# EAGLE schematic supply (EAGLE 5.10)
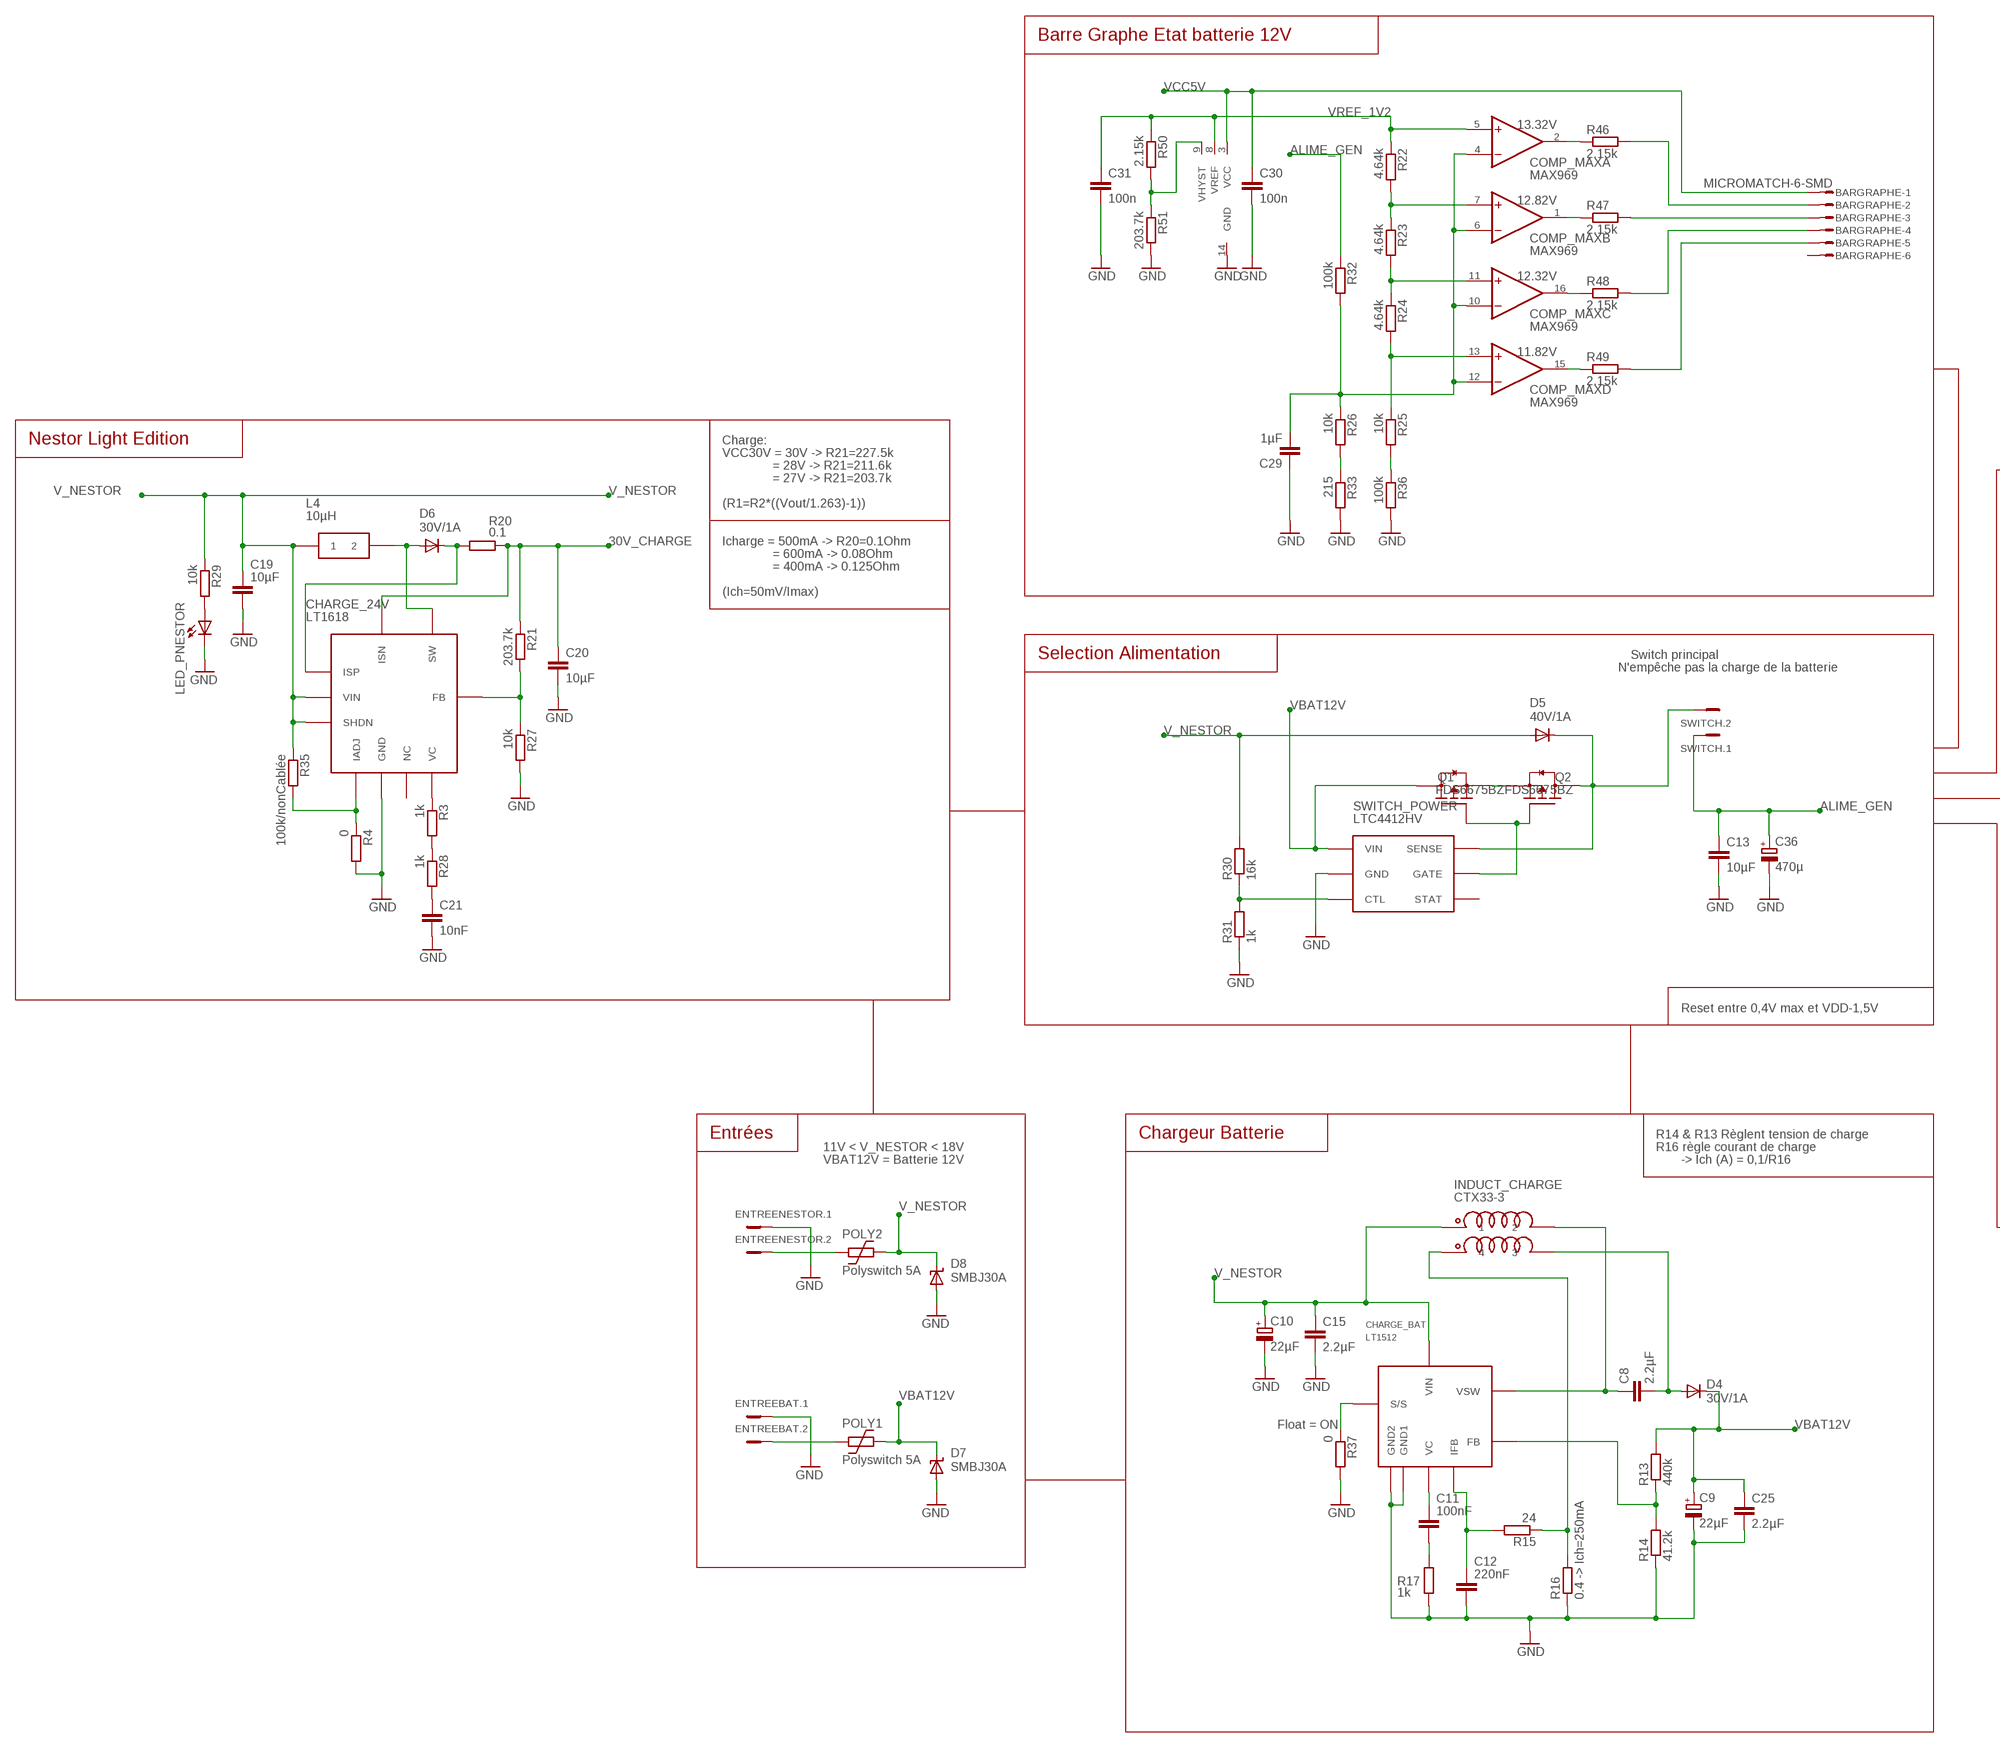
[diagram p0: schematic, sheet 1, part 1 of 2]
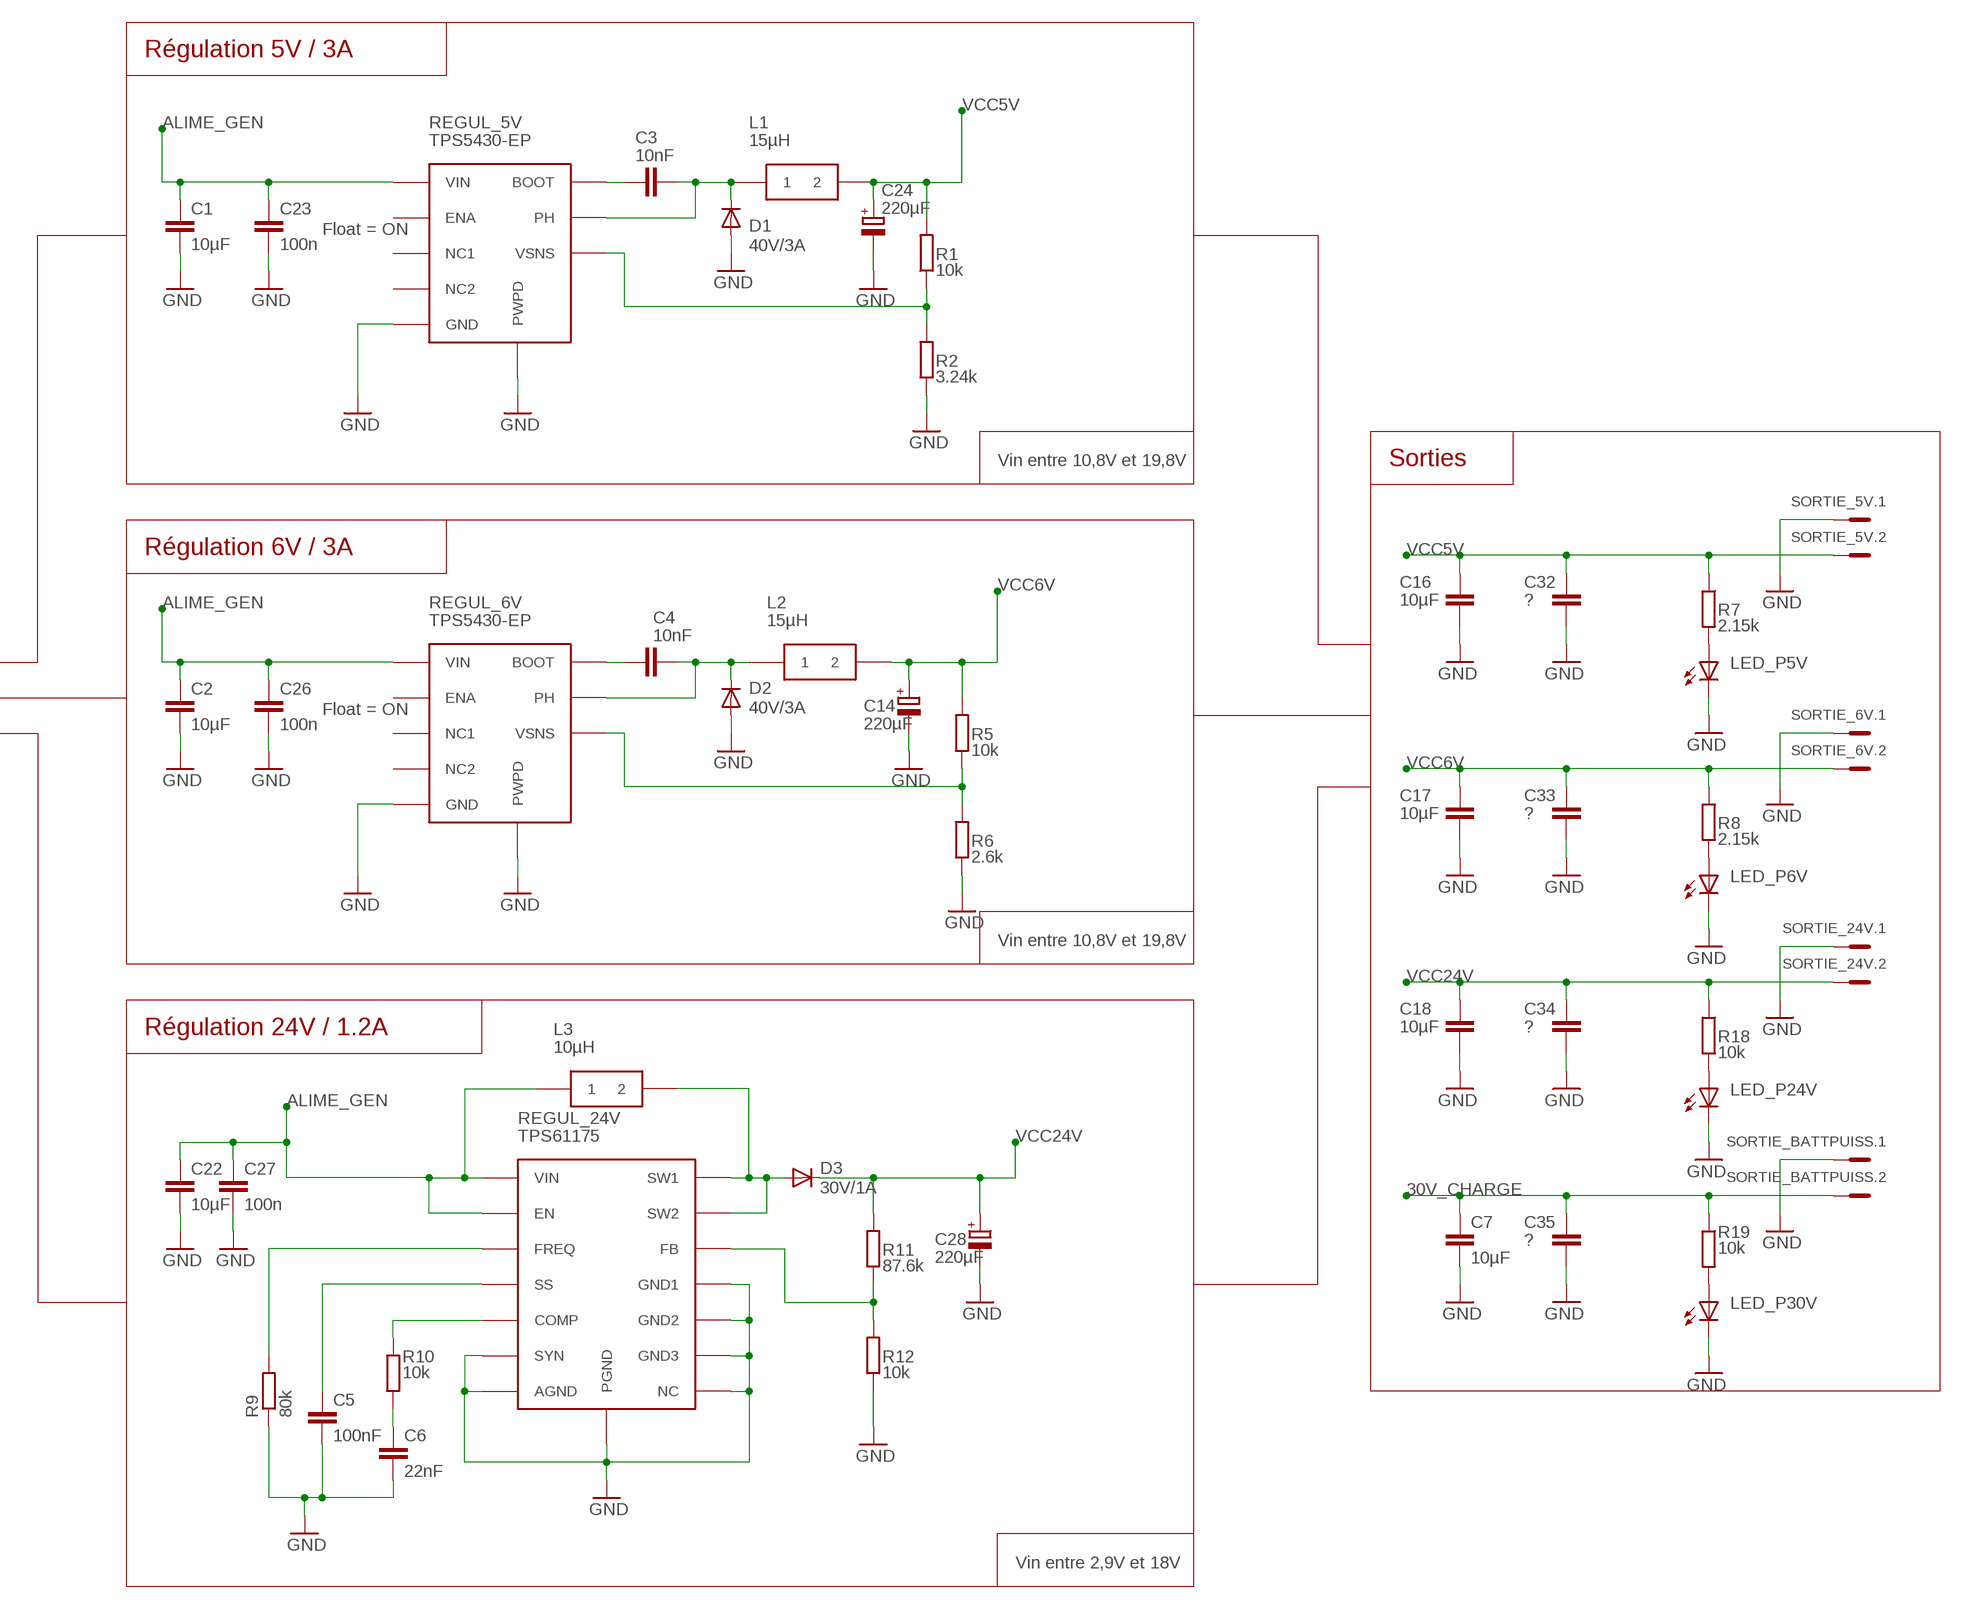
[diagram p1: schematic, sheet 1, part 2 of 2]

## Parts
BARGRAPHE  MICROMATCH-6-SMD  [MICROMATCH-6-SMD]
C1  10µF  C-EUC1210  [C1210]
C2  10µF  C-EUC1210  [C1210]
C3  10nF  C-EUC0603  [C0603]
C4  10nF  C-EUC0603  [C0603]
C5  100nF  C-EUC0603  [C0603]
C6  22nF  C-EUC0603  [C0603]
C7  10µF  C-EUC1210  [C1210]
C8  2.2µF  C-EUC0805  [C0805]
C9  22µF  CPOL-EUD/7343-31R  [D/7343-31R]
C10  22µF  CPOL-EUD/7343-31R  [D/7343-31R]
C11  100nF  C-EUC0603  [C0603]
C12  220nF  C-EUC0603  [C0603]
C13  10µF  C-EUC1210  [C1210]
C14  220µF  CPOL-EUD/7343-31R  [D/7343-31R]
C15  2.2µF  C-EUC0805  [C0805]
C16  10µF  C-EUC1210  [C1210]
C17  10µF  C-EUC1210  [C1210]
C18  10µF  C-EUC1210  [C1210]
C19  10µF  C-EUC1210  [C1210]
C20  10µF  C-EUC1210  [C1210]
C21  10nF  C-EUC0603  [C0603]
C22  10µF  C-EUC1210  [C1210]
C23  100n  C-EUC0603  [C0603]
C24  220µF  CPOL-EUD/7343-31R  [D/7343-31R]
C25  2.2µF  C-EUC0805  [C0805]
C26  100n  C-EUC0603  [C0603]
C27  100n  C-EUC0603  [C0603]
C28  220µF  CPOL-EUD/7343-31R  [D/7343-31R]
C29  1µF  C-EUC0603  [C0603]
C30  100n  C-EUC0603  [C0603]
C31  100n  C-EUC0603  [C0603]
C32  ?  C-EUC1210  [C1210]
C33  ?  C-EUC1210  [C1210]
C34  ?  C-EUC1210  [C1210]
C35  ?  C-EUC1210  [C1210]
C36  470µ  CPOL-EUE5-5  [E5-5]
CHARGE_24V  LT1618  [MSOP10]
CHARGE_BAT  LT1512  [LT1512]
COMP_MAX  MAX969  [QSOP16]
D1  40V/3A  DIODE-SMB  [SMB]
D2  40V/3A  DIODE-SMB  [SMB]
D3  30V/1A  DIODE-SMB  [SMB]
D4  30V/1A  DIODE-SMB  [SMB]
D5  40V/1A  DIODE-SMB  [SMB]
D6  30V/1A  DIODE-SMB  [SMB]
D7  SMBJ30A  SUPPRESSOR-SMBJ  [SMBJ]
D8  SMBJ30A  SUPPRESSOR-SMBJ  [SMBJ]
ENTREEBAT  MC2  [MC2]
ENTREENESTOR  MC2  [MC2]
INDUCT_CHARGE  CTX33-3  [CTX33-3]
L1  15µH  INDUCTANCE1  [INDUCTANCE]
L2  15µH  INDUCTANCE1  [INDUCTANCE]
L3  10µH  INDUCTANCE1  [INDUCTANCE]
L4  10µH  INDUCTANCE2  [INDUCTANCE2]
LED_P5V  Bling  LEDCHIPLED_1206  [CHIPLED_1206]
LED_P6V  Bling  LEDCHIPLED_1206  [CHIPLED_1206]
LED_P24V  Bling  LEDCHIPLED_1206  [CHIPLED_1206]
LED_P30V  Bling  LEDCHIPLED_1206  [CHIPLED_1206]
LED_PNESTOR  Bling  LEDCHIPLED_1206  [CHIPLED_1206]
POLY1  Polyswitch 5A  POLYSWITCH_0411/12  [0411/12]
POLY2  Polyswitch 5A  POLYSWITCH_0411/12  [0411/12]
Q1  FDS6675BZ  MOSFET-PCH_SO-8  [SOIC127P600X175-8AN]
Q2  FDS6675BZ  MOSFET-PCH_SO-8  [SOIC127P600X175-8AN]
R1  10k  R-EU_R0603  [R0603]
R2  3.24k  R-EU_R0603  [R0603]
R3  1k  R-EU_R0603  [R0603]
R4  0  R-EU_R0603  [R0603]
R5  10k  R-EU_R0603  [R0603]
R6  2.6k  R-EU_R0603  [R0603]
R7  2.15k  R-EU_R0603  [R0603]
R8  2.15k  R-EU_R0603  [R0603]
R9  80k  R-EU_R0603  [R0603]
R10  10k  R-EU_R0603  [R0603]
R11  87.6k  R-EU_R0603  [R0603]
R12  10k  R-EU_R0603  [R0603]
R13  440k  R-EU_R0603  [R0603]
R14  41.2k  R-EU_R0603  [R0603]
R15  24  R-EU_R0603  [R0603]
R16  0.4 -> Ich=250mA  R-EU_R0603  [R0603]
R17  1k  R-EU_R0603  [R0603]
R18  10k  R-EU_R0603  [R0603]
R19  10k  R-EU_R0603  [R0603]
R20  0.1  R-EU_R0603  [R0603]
R21  203.7k  R-EU_R0603  [R0603]
R22  4.64k  R-EU_R0603  [R0603]
R23  4.64k  R-EU_R0603  [R0603]
R24  4.64k  R-EU_R0603  [R0603]
R25  10k  R-EU_R0603  [R0603]
R26  10k  R-EU_R0603  [R0603]
R27  10k  R-EU_R0603  [R0603]
R28  1k  R-EU_R0603  [R0603]
R29  10k  R-EU_R0603  [R0603]
R30  16k  R-EU_R0603  [R0603]
R31  1k  R-EU_R0603  [R0603]
R32  100k  R-EU_R0603  [R0603]
R33  215  R-EU_R0603  [R0603]
R35  100k/nonCablée  R-EU_R0603  [R0603]
R36  100k  R-EU_R0603  [R0603]
R37  0  R-EU_R0603  [R0603]
R46  2.15k  R-EU_R0603  [R0603]
R47  2.15k  R-EU_R0603  [R0603]
R48  2.15k  R-EU_R0603  [R0603]
R49  2.15k  R-EU_R0603  [R0603]
R50  2.15k  R-EU_R0603  [R0603]
R51  203.7k  R-EU_R0603  [R0603]
REGUL_5V  TPS5430-EP  [TPS5430-EP]
REGUL_6V  TPS5430-EP  [TPS5430-EP]
REGUL_24V  TPS61175  [TPS61175]
SORTIE_5V  MC2  [MC2]
SORTIE_6V  MC2  [MC2]
SORTIE_24V  MC2  [MC2]
SORTIE_BATTPUISS  MC2  [MC2]
SWITCH  MC2  [MC2]
SWITCH_POWER  LTC4412HV  [LTC4412HV]

## Nets
30V_CHARGE: C7.1 C20.1 C35.1 CHARGE_24V.2(ISN) R19.1 R20.1 R21.1 SORTIE_BATTPUISS.2
ALIME_GEN: C1.1 C2.1 C13.1 C22.1 C23.1 C26.1 C27.1 C36.+ L3.P$1 R32.1 REGUL_5V.P$7(VIN) REGUL_6V.P$7(VIN) REGUL_24V.P$3(VIN) REGUL_24V.P$4(EN) SWITCH.1
GND: C1.2 C2.2 C5.2 C6.2 C7.2 C9.- C10.- C12.2 C13.2 C14.- C15.2 C16.2 C17.2 C18.2 C19.2 C20.2 C21.2 C22.2 C23.2 C24.- C25.2 C26.2 C27.2 C28.- C29.1 C30.2 C31.2 C32.2 C33.2 C34.2 C35.2 C36.- CHARGE_24V.5(GND) CHARGE_BAT.P$6(GND2) CHARGE_BAT.P$7(GND1) COMP_MAX.14(GND) D1.A D2.A D7.A D8.A ENTREEBAT.1 ENTREENESTOR.1 LED_P5V.C LED_P6V.C LED_P24V.C LED_P30V.C LED_PNESTOR.C R2.1 R4.2 R6.1 R9.1 R12.1 R14.1 R16.1 R17.1 R27.2 R31.1 R33.2 R36.2 R37.2 R51.2 REGUL_5V.P$6(GND) REGUL_5V.P$9(PWPD) REGUL_6V.P$6(GND) REGUL_6V.P$9(PWPD) REGUL_24V.P$6(SYN) REGUL_24V.P$7(AGND) REGUL_24V.P$11(NC) REGUL_24V.P$12(GND1) REGUL_24V.P$13(GND2) REGUL_24V.P$14(GND3) REGUL_24V.P$15(PGND) SORTIE_5V.1 SORTIE_6V.1 SORTIE_24V.1 SORTIE_BATTPUISS.1 SWITCH_POWER.P$2(GND)
N$2: C4.1 REGUL_6V.P$1(BOOT)
N$3: C3.1 REGUL_5V.P$1(BOOT)
N$4: C3.2 D1.C L1.P$1 REGUL_5V.P$8(PH)
N$5: R1.1 R2.2 REGUL_5V.P$4(VSNS)
N$6: C4.2 D2.C L2.P$1 REGUL_6V.P$8(PH)
N$7: R5.1 R6.2 REGUL_6V.P$4(VSNS)
N$8: CHARGE_24V.10(VC) R3.1
N$9: R11.1 R12.2 REGUL_24V.P$9(FB)
N$10: D3.A L3.P$2 REGUL_24V.P$1(SW1) REGUL_24V.P$2(SW2)
N$11: C8.1 CHARGE_BAT.P$8(VSW) INDUCT_CHARGE.P$2
N$12: R9.2 REGUL_24V.P$10(FREQ)
N$13: C5.1 REGUL_24V.P$5(SS)
N$14: C8.2 D4.A INDUCT_CHARGE.P$3
N$15: INDUCT_CHARGE.P$4 R15.1 R16.2
N$16: C6.1 R10.1
N$17: R10.2 REGUL_24V.P$8(COMP)
N$18: C11.1 CHARGE_BAT.P$1(VC)
N$19: C11.2 R17.2
N$20: COMP_MAX.7(B:+IN) R22.2 R23.1
N$21: ENTREENESTOR.2 POLY2.1
N$22: C12.1 CHARGE_BAT.P$3(IFB) R15.2
N$23: Q1.4(G) Q2.4(G) SWITCH_POWER.P$5(GATE)
N$24: LED_P5V.A R7.2
N$25: LED_P6V.A R8.2
N$26: CHARGE_BAT.P$2(FB) R13.1 R14.2
N$27: COMP_MAX.2(A:OUT) R46.1
N$28: LED_P24V.A R18.2
N$29: COMP_MAX.11(C:+IN) R23.2 R24.1
N$30: COMP_MAX.13(D:+IN) R24.2 R25.1
N$31: COMP_MAX.9(VHYST) R50.2 R51.1
N$32: C29.2 COMP_MAX.4(A:-IN) COMP_MAX.6(B:-IN) COMP_MAX.10(C:-IN) COMP_MAX.12(D:-IN) R26.1 R32.2
N$33: LED_P30V.A R19.2
N$34: CHARGE_24V.4(IADJ) R4.1 R35.2
N$35: CHARGE_BAT.P$4(S/S) R37.1
N$36: C21.1 R28.2
N$37: COMP_MAX.1(B:OUT) R47.1
N$38: CHARGE_24V.1(FB) R21.2 R27.1
N$39: ENTREEBAT.2 POLY1.1
N$40: LED_PNESTOR.A R29.2
N$41: R30.1 R31.2 SWITCH_POWER.P$3(CTL)
N$43: Q1.1(S) Q2.1(S)
N$45: R26.2 R33.1
N$46: R25.2 R36.1
N$47: R3.2 R28.1
N$48: CHARGE_24V.3(ISP) D6.C R20.2
N$50: CHARGE_24V.7(SW) D6.A L4.P$2
N$55: COMP_MAX.16(C:OUT) R48.1
N$56: BARGRAPHE.2 R46.2
N$57: BARGRAPHE.3 R47.2
N$58: BARGRAPHE.4 R48.2
N$61: COMP_MAX.15(D:OUT) R49.1
N$62: BARGRAPHE.5 R49.2
V_NESTOR: C10.+ C15.1 C19.1 CHARGE_24V.8(VIN) CHARGE_24V.9(SHDN) CHARGE_BAT.P$5(VIN) D5.A D8.C INDUCT_CHARGE.P$1 L4.P$1 POLY2.2 R29.1 R30.2 R35.1
VBAT12V: C9.+ C25.1 D4.C D7.C POLY1.2 Q1.5(D) R13.2 SWITCH_POWER.P$1(VIN)
VCC5V: BARGRAPHE.1 C16.1 C24.+ C30.1 C32.1 COMP_MAX.3(VCC) L1.P$2 R1.2 R7.1 SORTIE_5V.2
VCC6V: C14.+ C17.1 C33.1 L2.P$2 R5.2 R8.1 SORTIE_6V.2
VCC12V_1: D5.C Q2.5(D) SWITCH.2 SWITCH_POWER.P$6(SENSE)
VCC24V: C18.1 C28.+ C34.1 D3.C R11.2 R18.1 SORTIE_24V.2
VREF_1V2: C31.1 COMP_MAX.5(A:+IN) COMP_MAX.8(VREF) R22.1 R50.1
Unconnected: BARGRAPHE.6 CHARGE_24V.6(NC) REGUL_5V.P$2(NC1) REGUL_5V.P$3(NC2) REGUL_5V.P$5(ENA) REGUL_6V.P$2(NC1) REGUL_6V.P$3(NC2) REGUL_6V.P$5(ENA) SWITCH_POWER.P$4(STAT)

## Notes on the sheet
- Barre Graphe Etat batterie 12V
- 13.32V
- 12.82V
- 12.32V
- Régulation 5V / 3A
- 11.82V
- Nestor Light Edition | Charge:
- VCC30V = 30V -> R21=227.5k
- = 28V -> R21=211.6k | Float = ON
- = 27V -> R21=203.7k
- (R1=R2*((Vout/1.263)-1))
- Icharge = 500mA -> R20=0.1Ohm
- = 600mA -> 0.08Ohm
- = 400mA -> 0.125Ohm
- (Ich=50mV/Imax)
- Vin entre 10,8V et 19,8V | Sorties
- Selection Alimentation | Switch principal
- N'empêche pas la charge de la batterie
- Régulation 6V / 3A
- Float = ON
- Vin entre 10,8V et 19,8V
- Reset entre 0,4V max et VDD-1,5V
- Régulation 24V / 1.2A
- Entrées | Chargeur Batterie | R14 & R13 Règlent tension de charge
- 11V < V_NESTOR < 18V | R16 règle courant de charge
- VBAT12V = Batterie 12V | -> Ich (A) = 0,1/R16
- Vin entre 2,9V et 18V
- Float = ON

## Library data of the parts
BARGRAPHE = apbteam_con-amp-micromatch:MICROMATCH-6: MicroMaTch 6
C1-C8 C11-C13 C15-C23 C25-C27 C29-C35 = rcl:C-EU: CAPACITOR, European symbol
C9 C10 C14 C24 C28 C36 = rcl:CPOL-EU: POLARIZED CAPACITOR, European symbol
CHARGE_24V = apbTeam:LT1618
CHARGE_BAT = apbTeam:LT1512
COMP_MAX = maxim-7:MAX969
D1-D6 = diode:DIODE-: DIODE
D7 D8 = diode:SUPPRESSOR-: Suppressor diode
ENTREEBAT ENTREENESTOR SORTIE_5V SORTIE_6V SORTIE_24V SORTIE_BATTPUISS SWITCH = con-phoenix-381_l:MC2: Mini-Combicon 3.81mm horizontal 2-polig MC 1,5/2-G-3,81 Artikel-Nr. 1803277
INDUCT_CHARGE = apbTeam:CTX33-3
L1-L3 = apbTeam:INDUCTANCE1: 12x12 mm
L4 = apbTeam:INDUCTANCE2: 6x6 mm
LED_P5V LED_P6V LED_P24V LED_P30V LED_PNESTOR = led:LED: LED OSRAM: - CHIPLED LG R971, LG N971, LY N971, LG Q971, LY Q971, LO R971, LY R971 LH N974, LH R974 LS Q976, LO Q976, LY Q976 LO Q996 - Hyper CHIPLED LW Q18S LB Q993, LB Q99A, LB R99A - SideLED LS A670, LO A670, LY A670, LG A670, LP A670 LB A673, LV A673, LT A673, LW A673 LH A674 LY A675 LS A676, LA A676, LO A676, LY A676, LW A676 LS A679, LY A679, LG A679 - Hyper Micro SIDELED® LS Y876, LA Y876, LO Y876, LY Y876 LT Y87S - SmartLED LW L88C, LW L88S LB L89C, LB L89S, LG L890 LS L89K, LO L89K, LY L89K LS L896, LA L896, LO L896, LY L896 - TOPLED LS T670, LO T670, LY T670, LG T670, LP T670 LSG T670, LSP T670, LSY T670, LOP T670, LYG T670 LG T671, LOG T671, LSG T671 LB T673, LV T673, LT T673, LW T673 LH T674 LS T676, LA T676, LO T676, LY T676, LB T676, LH T676, LSB T676, LW T676 LB T67C, LV T67C, LT T67C, LS T67K, LO T67K, LY T67K, LW E67C LS E67B, LA E67B, LO E67B, LY E67B, LB E67C, LV E67C, LT E67C LW T67C LS T679, LY T679, LG T679 LS T770, LO T770, LY T770, LG T770, LP T770 LB T773, LV T773, LT T773, LW T773 LH T774 LS E675, LA E675, LY E675, LS T675 LS T776, LA T776, LO T776, LY T776, LB T776 LHGB T686 LT T68C, LB T68C - Hyper Mini TOPLED® LB M676 - Mini TOPLED Santana® LG M470 LS M47K, LO M47K, LY M47K Source: http://www.osram.convergy.de/
POLY1 POLY2 = apbteam_polyswitch:POLYSWITCH_: POLYSWITCH
Q1 Q2 = FairChild-transistor:MOSFET-PCH_
R1-R33 R35-R37 R46-R51 = rcl:R-EU_: RESISTOR, European symbol
REGUL_5V REGUL_6V = apbTeam:TPS5430-EP
REGUL_24V = apbTeam:TPS61175
SWITCH_POWER = apbTeam:LTC4412HV